# EAGLE design Photobooth-Connector (EAGLE 7.1.0)
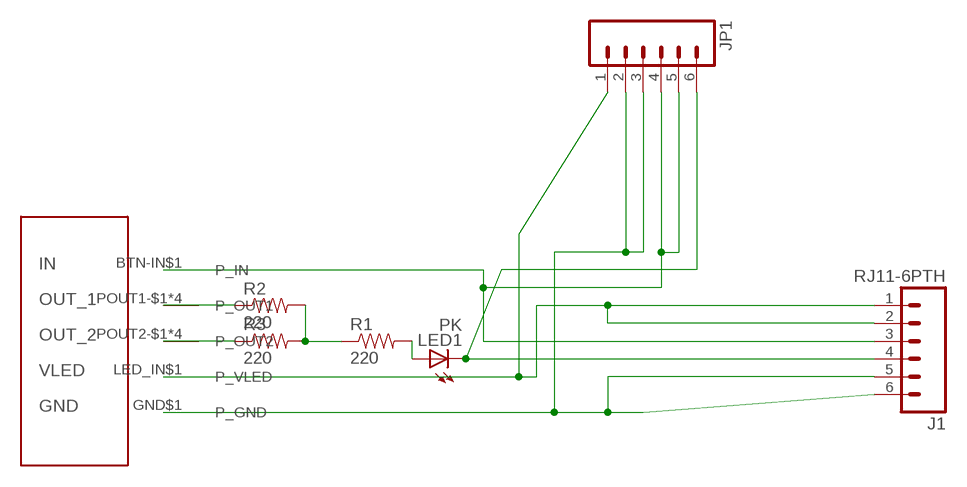
[diagram p0: schematic, sheet 1]

## Parts
J1  RJ11-6PTH  [RJ11-6]
JP1  M06LOCK  [1X06_LOCK]
LED1  PK  LEDCHIP-LED0805  [CHIP-LED0805]
R1  220  RESISTOR0805-RES  [0805]
R2  220  RESISTOR0805-RES  [0805]
R3  220  RESISTOR0805-RES  [0805]
U$1  KERMIS_BUTTON  [SLOT_DRILLED]

## Nets
N$1: J1.3 JP1.4 JP1.5 U$1.BTN-IN$1(P_IN)
N$2: J1.4 JP1.6 LED1.C
N$3: R1.1 R2.2 R3.2
N$4: LED1.A R1.2
N$5: J1.1 J1.2 JP1.1 U$1.LED_IN$1(P_VLED)
N$6: J1.5 J1.6 JP1.2 JP1.3 U$1.GND$1(P_GND)
N$7: R2.1 U$1.POUT1-$1(P_OUT1) U$1.POUT1-$2(P_OUT1) U$1.POUT1-$3(P_OUT1) U$1.POUT1-$4(P_OUT1)
N$8: R3.1 U$1.POUT2-$1(P_OUT2) U$1.POUT2-$2(P_OUT2) U$1.POUT2-$3(P_OUT2) U$1.POUT2-$4(P_OUT2)

## Library data of the parts
J1 = SparkFun-Connectors:RJ11-6: RJ11 Jack Simple 6 pin RJ11 jack. Commonly found on CAT3 devices and Microchip programmers. SKU: PRT-00132
JP1 = SparkFun-Connectors:M06: Header 6 Standard 6-pin 0.1" header. Use with straight break away headers (SKU : PRT-00116), right angle break away headers (PRT-00553), swiss pins (PRT-00743), machine pins (PRT-00117), and female headers (PRT-00115). Molex polarized connector foot print use with SKU : PRT-08094 with associated crimp pins and housings. NOTES ON THE VARIANTS LOCK and LOCK_LONGPADS... This footprint was designed to help hold the alignment of a through-hole component (i.e. 6-pin header) while soldering it into place. You may notice that each hole has been shifted either up or down by 0.005 of an inch from it's more standard position (which is a perfectly straight line). This slight alteration caused the pins (the squares in the middle) to touch the edges of the holes. Because they are alternating, it causes a "brace" to hold the component in place. 0.005 has proven to be the perfect amount of "off-center" position when using our standard breakaway headers. Although looks a little odd when you look at the bare footprint, once you have a header in there, the alteration is very hard to notice. Also,if you push a header all the way into place, it is covered up entirely on the bottom side. This idea of altering the position of holes to aid alignment will be further integrated into the Sparkfun Library for other footprints. It can help hold any component with 3 or more connection pins.
LED1 = led:LED: LED OSRAM: - CHIPLED LG R971, LG N971, LY N971, LG Q971, LY Q971, LO R971, LY R971 LH N974, LH R974 LS Q976, LO Q976, LY Q976 LO Q996 - Hyper CHIPLED LW Q18S LB Q993, LB Q99A, LB R99A - SideLED LS A670, LO A670, LY A670, LG A670, LP A670 LB A673, LV A673, LT A673, LW A673 LH A674 LY A675 LS A676, LA A676, LO A676, LY A676, LW A676 LS A679, LY A679, LG A679 - Hyper Micro SIDELED® LS Y876, LA Y876, LO Y876, LY Y876 LT Y87S - SmartLED LW L88C, LW L88S LB L89C, LB L89S, LG L890 LS L89K, LO L89K, LY L89K LS L896, LA L896, LO L896, LY L896 - TOPLED LS T670, LO T670, LY T670, LG T670, LP T670 LSG T670, LSP T670, LSY T670, LOP T670, LYG T670 LG T671, LOG T671, LSG T671 LB T673, LV T673, LT T673, LW T673 LH T674 LS T676, LA T676, LO T676, LY T676, LB T676, LH T676, LSB T676, LW T676 LB T67C, LV T67C, LT T67C, LS T67K, LO T67K, LY T67K, LW E67C LS E67B, LA E67B, LO E67B, LY E67B, LB E67C, LV E67C, LT E67C LW T67C LS T679, LY T679, LG T679 LS T770, LO T770, LY T770, LG T770, LP T770 LB T773, LV T773, LT T773, LW T773 LH T774 LS E675, LA E675, LY E675, LS T675 LS T776, LA T776, LO T776, LY T776, LB T776 LHGB T686 LT T68C, LB T68C - Hyper Mini TOPLED® LB M676 - Mini TOPLED Santana® LG M470 LS M47K, LO M47K, LY M47K Source: http://www.osram.convergy.de LUXEON: - LUMILED® LXK2-PW12-R00, LXK2-PW12-S00, LXK2-PW14-U00, LXK2-PW14-V00 LXK2-PM12-R00, LXK2-PM12-S00, LXK2-PM14-U00 LXK2-PE12-Q00, LXK2-PE12-R00, LXK2-PE12-S00, LXK2-PE14-T00, LXK2-PE14-U00 LXK2-PB12-K00, LXK2-PB12-L00, LXK2-PB12-M00, LXK2-PB14-N00, LXK2-PB14-P00, LXK2-PB14-Q00 LXK2-PR12-L00, LXK2-PR12-M00, LXK2-PR14-Q00, LXK2-PR14-R00 LXK2-PD12-Q00, LXK2-PD12-R00, LXK2-PD12-S00 LXK2-PH12-R00, LXK2-PH12-S00 LXK2-PL12-P00, LXK2-PL12-Q00, LXK2-PL12-R00 Source: www.luxeon.com KINGBRIGHT: KA-3528ASYC Source: www.kingbright.com
R1-R3 = SparkFun-Passives:RESISTOR: Resistor Basic schematic elements and footprints for 0603, 1206, and PTH resistors.
U$1 = PATser:KERMIS_BUTTON: Lighted button connector. Use for stable connection

## Board
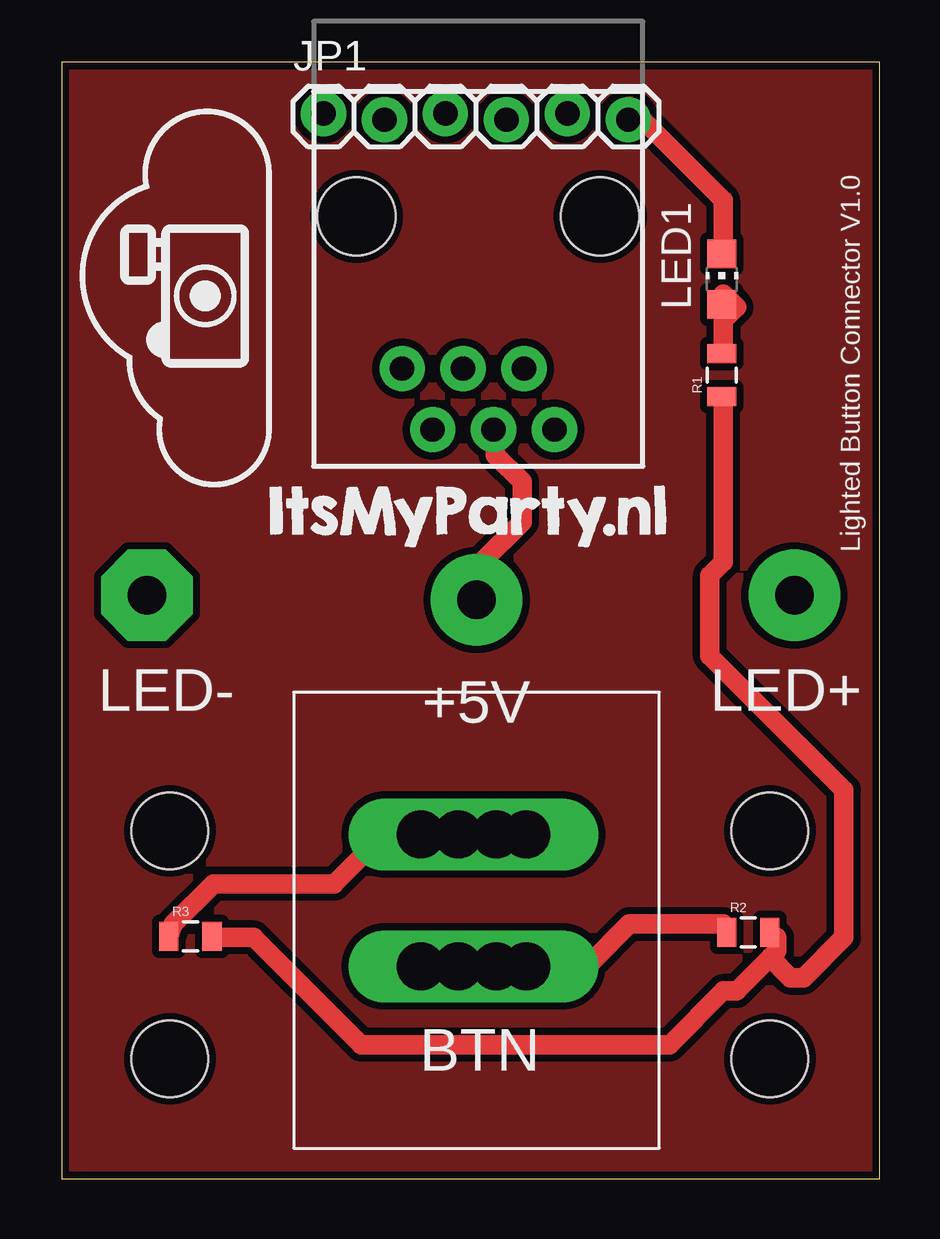
[diagram p1: board, top side]
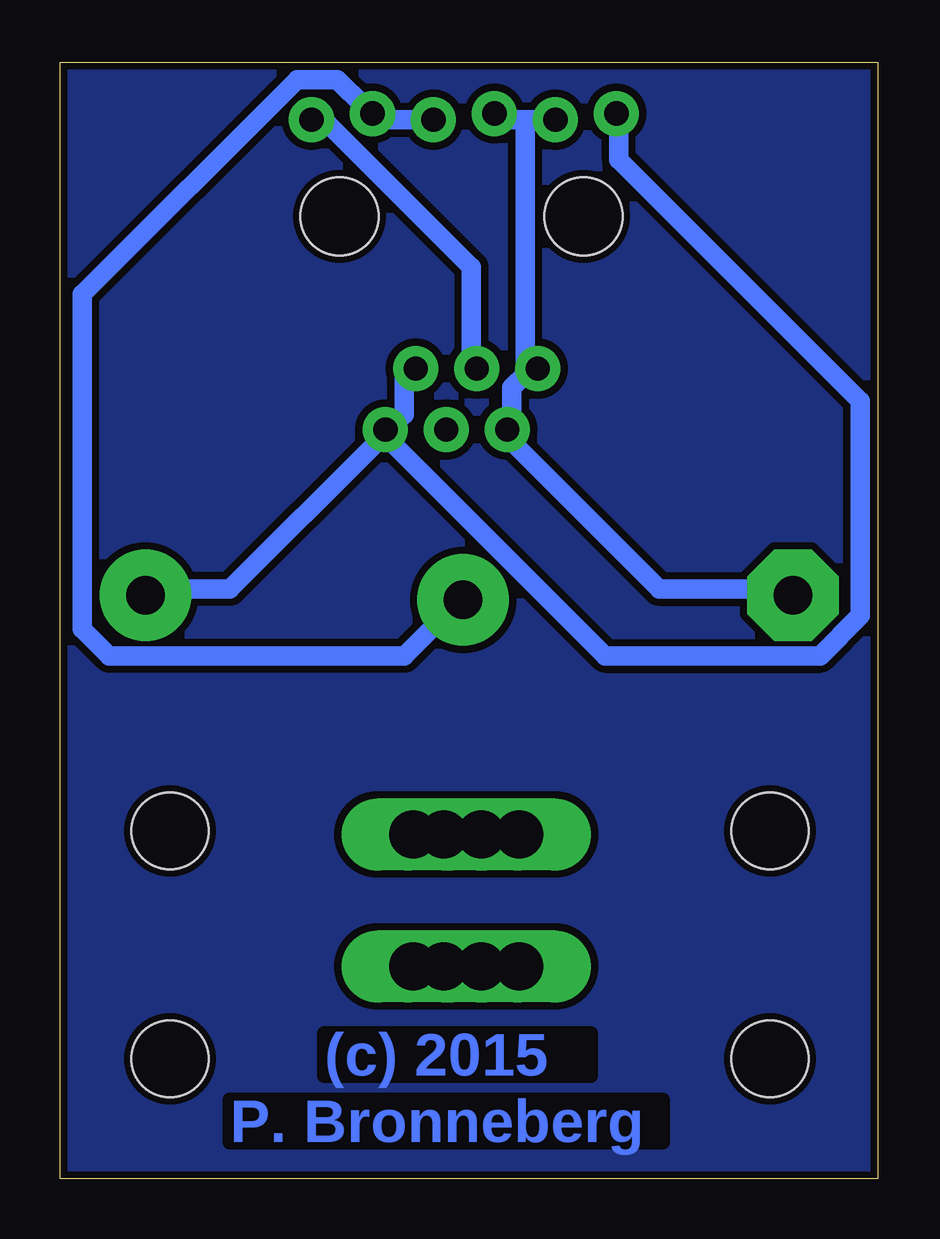
[diagram p2: board, bottom side, seen from below]

Size 34.08 x 46.54 mm. Coordinates in mm from the lower left corner, seen from the top.
Outline: 0,0 34.08,0 34.08,46.54 0,46.54 0,0
Copper layers (1*16): Top 0.035mm / dielectric 1.5mm / Bottom 0.035mm
Design rules "SparkFun-2-layer *": minimum track width 32mil, minimum drill 15mil, track to track 12mil, track to pad 8mil, pad to pad 8mil, via to via 8mil, smd to smd 8mil, copper to edge 12mil, drill to drill 8mil, minimum pad ring 12mil, minimum via ring 10mil, stop-mask expansion 4mil, vias tented up to drill 20mil, thermal gap 10mil
Holes 3.2 mm at 4.5,14.5 29.5,14.5 29.5,5 4.5,5

### Footprints (pad centres in the part's own frame; a part is rotated, then mirrored left to right if it is on the bottom)
RJ11-6 = drill 1.016 pad 1.88: 1 1.905,8.89; 2 3.175,6.35; 3 4.445,8.89; 4 5.715,6.35; 5 6.985,8.89; 6 8.255,6.35 | hole 3.251: 0,0; 10.16,0
1X06_LOCK = drill 1.016 pad 1.88: 1 0,0; 2 2.54,-0.254; 3 5.08,0; 4 7.62,-0.254; 5 10.16,0; 6 12.7,-0.254
CHIP-LED0805 = smd 1.2 x 1.2: A 0,-1.05; C 0,1.05
0805 = smd 0.8 x 1.2: 1 -0.9,0; 2 0.9,0
SLOT_DRILLED = drill 1.6 pad 3.81: BTN-IN$1 -7.39,22.86; LED_IN$1 5.85,23.05 | drill 1.6 pad 3.81 octagon: GND$1 -21.13,23.05 | drill 2 pad 2.54 long: POUT1-$1 -9.722,7.58; POUT1-$2 -8.152,7.58; POUT1-$3 -6.582,7.58; POUT1-$4 -5.312,7.58; POUT2-$1 -9.722,13.08; POUT2-$2 -8.152,13.08; POUT2-$3 -6.582,13.08; POUT2-$4 -5.312,13.08

### Placement (x,y rotation side)
J1  22.43,40.12 180 top
JP1  10.9,44.4 0 top
LED1  27.5,37.5 0 top
R1  27.5,33.5 90 top
R2  28.6,10.27 0 top
R3  5.36,10.11 0 top
U$1  24.67,1.27 0 top

### Tracks (layer width: path | path; a pad name or v marks a point on that pad's centre or on a via)
GND
  pour Top: 0.1,46.3 0,0 34,0 34.1,46.4
  pour Bottom: 0,46.3 0,0 34,0 34,46.5
N$1
  Top 0.813: J1.3 18.06,30.73 18.06,30.18 19.17,29.06 19.17,27.38 17.5,25.7 17.5,24.59 U$1.BTN-IN$1
  Bottom 0.813: JP1.4 18.62,44.15 20.85,44.15 JP1.5 21.41,44.7 22.53,45.82 24.2,45.82 33.14,36.88 33.14,22.91 32.03,21.79 19.73,21.79 17.5,24.03 U$1.BTN-IN$1
N$2
  Top 0.813: LED1.C 27.56,38.56 27.56,40.79 23.65,44.7 JP1.6
  Bottom 0.813: J1.4 16.94,34.09 16.94,38 23.09,44.15 JP1.6
N$3
  Top 0.813: 29.51,9.22 29.79,9.5 29.79,10.06 R2.2 | 29.51,9.22 28.12,7.82 27.56,7.82 25.32,5.59 12.47,5.59 8,10.06 6.32,10.06 R3.2 | 29.51,9.22 30.35,8.38 30.91,8.38 32.59,10.06 32.59,16.2 27,21.79 27,25.15 27.56,25.7 27.56,32.41 R1.1
N$4
  Top 0.813: R1.2 27.56,34.65 27.56,35.76 28.12,36.32 27.56,36.88 LED1.A
N$5
  Bottom 0.813: J1.2 19.73,33.53 19.73,31.85 20.29,31.29 J1.1 | JP1.1 10.79,44.15 10.79,42.47 0.73,32.41 0.73,23.47 2.41,21.79 11.35,21.79 20.29,30.73 J1.1 | U$1.LED_IN$1 30.35,24.59 27,24.59 20.85,30.73 J1.1
N$6
  Bottom 0.813: 14.7,44.15 15.82,44.15 JP1.3 | 14.7,44.15 13.59,44.15 JP1.2 | 14.7,44.15 14.7,34.09 J1.6 14.7,33.53 15.26,32.97 15.26,31.29 J1.5 15.26,30.73 9.12,24.59 4.09,24.59 U$1.GND$1
N$7
  Top 0.813: R2.1 27.56,10.62 23.65,10.62 21.97,8.94 19.73,8.94 U$1.POUT1-$3 16.38,8.94 | 16.38,8.94 15.26,8.94 U$1.POUT1-$1 16.38,8.94 | 16.38,8.94 U$1.POUT1-$2 19.17,8.94 U$1.POUT1-$4
N$8
  Top 0.813: U$1.POUT2-$4 19.17,14.53 18.62,14.53 U$1.POUT2-$3 18.06,14.53 16.94,14.53 U$1.POUT2-$2 16.38,14.53 15.26,14.53 U$1.POUT2-$1 14.7,13.97 13.03,13.97 11.35,12.29 6.32,12.29 4.65,10.62 R3.1

### Text on the board
Bottom: (c) 2015 | P. Bronneberg
tPlace: Lighted Button Connector V1.0 | LED- | LED+ | +5V | BTN | C:/Users/nly96192/Desktop/ItsMyPartyLogo2-TextOnly-bw.bmp